# EAGLE design Adafruit 2.7in Tri-Color eInk Display with EYESPI (EAGLE 9.6.2)
COMPANY: ADAFRUIT INDUSTRIES; DRAWN: K. TOWNSEND; REV: A
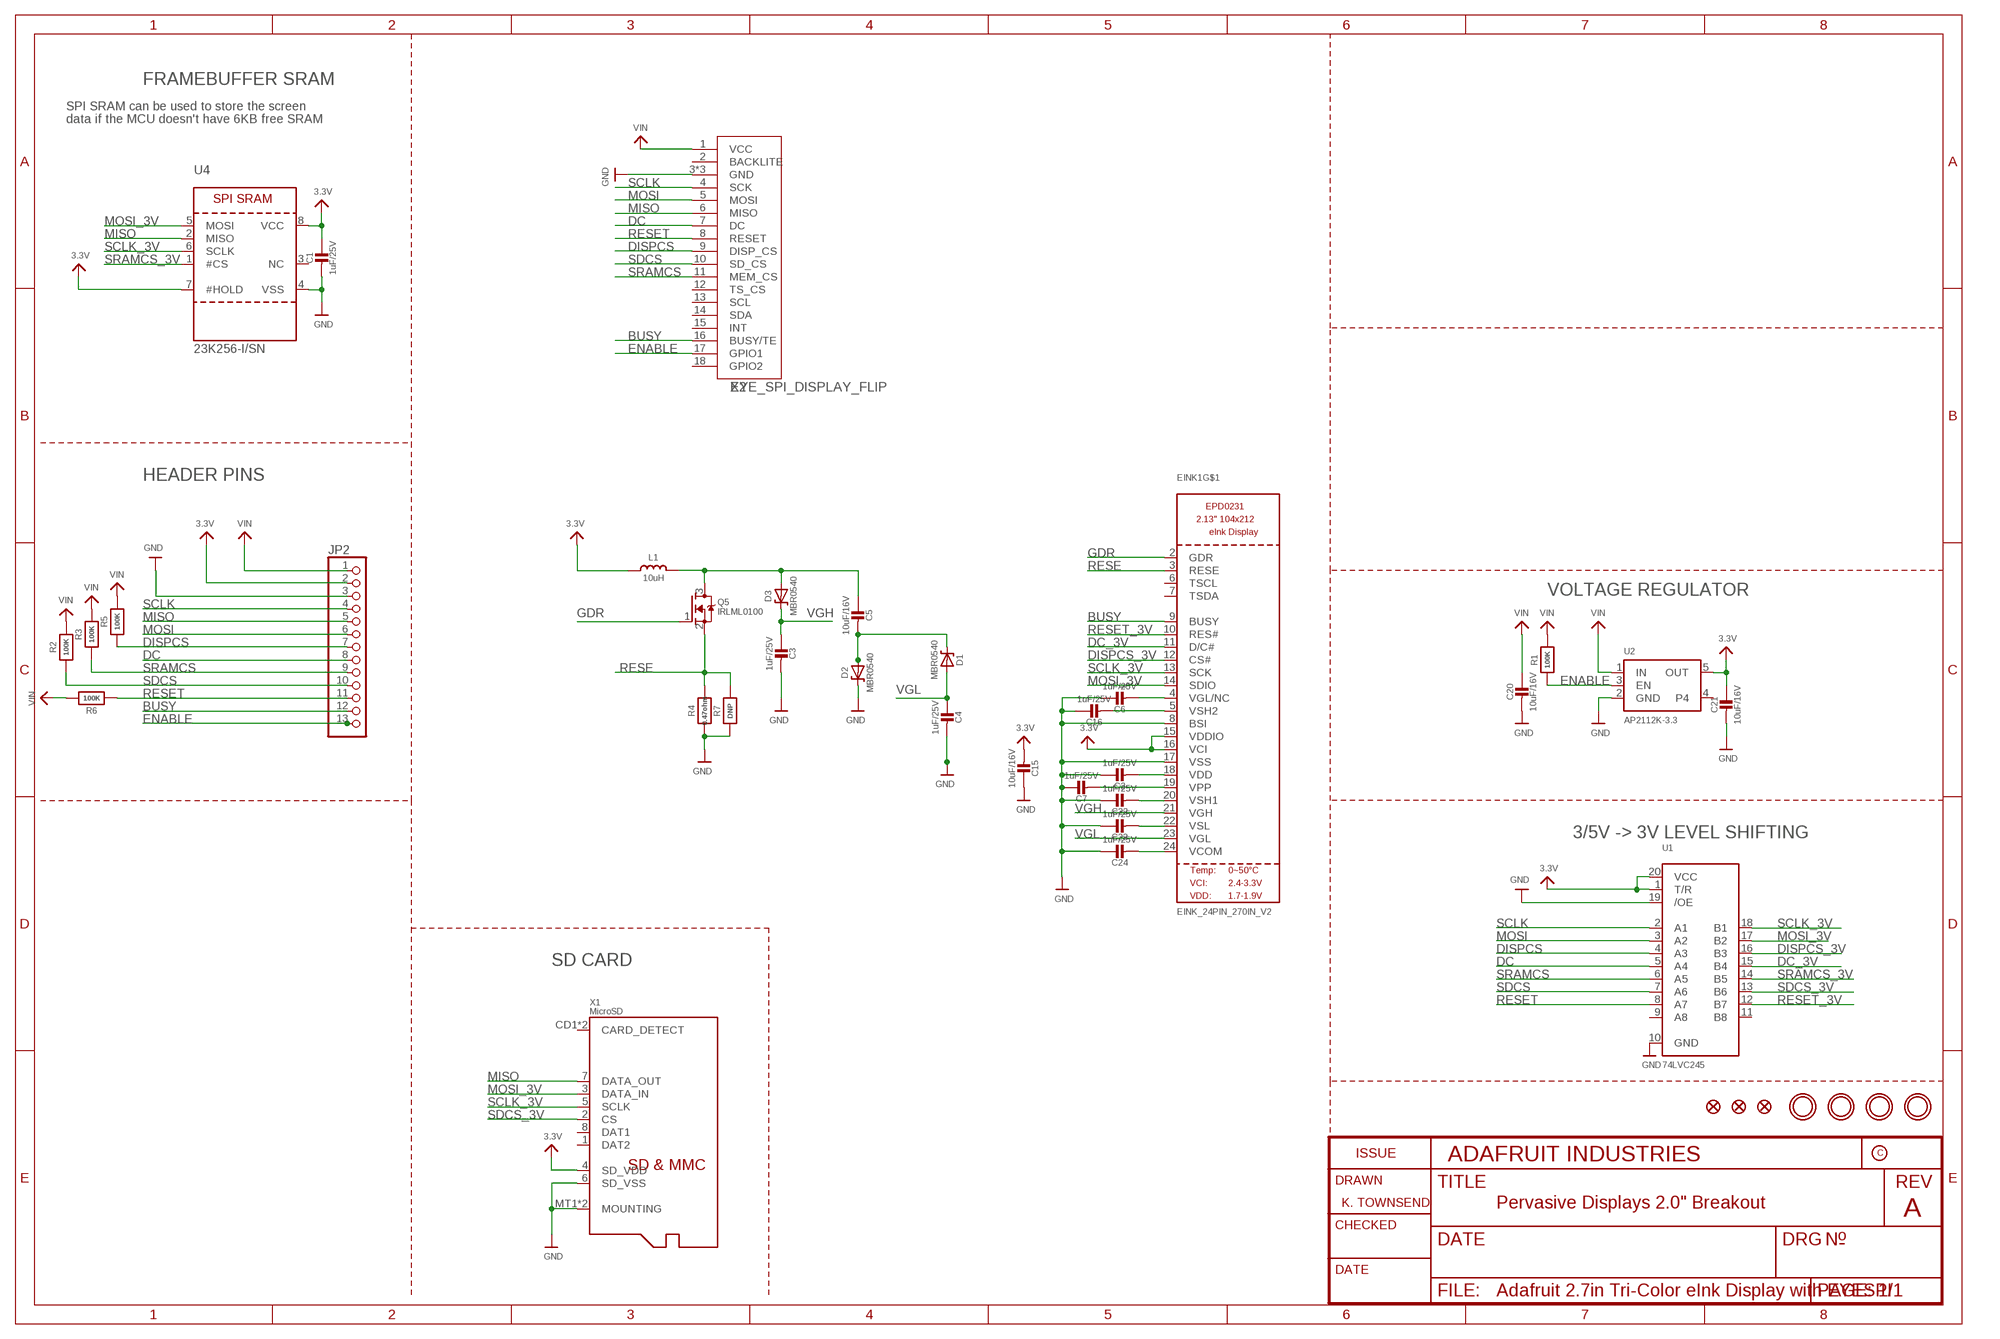
[diagram p0: schematic, sheet 1]

## Parts
C1  1uF/25V  CAP_CERAMIC0603_NO  [0603-NO]
C2  1uF/25V  CAP_CERAMIC0603_NO  [0603-NO]
C3  1uF/25V  CAP_CERAMIC0603_NO  [0603-NO]
C4  1uF/25V  CAP_CERAMIC0603_NO  [0603-NO]
C5  10uF/16V  CAP_CERAMIC0805-NOOUTLINE  [0805-NO]
C6  1uF/25V  CAP_CERAMIC0603_NO  [0603-NO]
C7  1uF/25V  CAP_CERAMIC0603_NO  [0603-NO]
C15  10uF/16V  CAP_CERAMIC0805-NOOUTLINE  [0805-NO]
C16  1uF/25V  CAP_CERAMIC0603_NO  [0603-NO]
C20  10uF/16V  CAP_CERAMIC0805-NOOUTLINE  [0805-NO]
C21  10uF/16V  CAP_CERAMIC0805-NOOUTLINE  [0805-NO]
C22  1uF/25V  CAP_CERAMIC0603_NO  [0603-NO]
C23  1uF/25V  CAP_CERAMIC0603_NO  [0603-NO]
C24  1uF/25V  CAP_CERAMIC0603_NO  [0603-NO]
D1  MBR0540  DIODE-SCHOTTKYSOD-123  [SOD-123]
D2  MBR0540  DIODE-SCHOTTKYSOD-123  [SOD-123]
D3  MBR0540  DIODE-SCHOTTKYSOD-123  [SOD-123]
EINK1  EINK_24PIN_270IN_V2  [EINK_270IN_V2]
FID1  FIDUCIAL_1MM  [FIDUCIAL_1MM]
FID2  FIDUCIAL_1MM  [FIDUCIAL_1MM]
FID3  FIDUCIAL_1MM  [FIDUCIAL_1MM]
JP2  HEADER-1X13  [1X13_ROUND_70]
L1  10uH  INDUCTORNR401  [INDUCTOR_4X4MM_NR401]
Q5  IRLML0100  MOSFET-NWIDE  [SOT23-WIDE]
R1  100K  RESISTOR_0603_NOOUT  [0603-NO]
R2  100K  RESISTOR_0603_NOOUT  [0603-NO]
R3  100K  RESISTOR_0603_NOOUT  [0603-NO]
R4  0.47ohm  RESISTOR_0603_NOOUT  [0603-NO]
R5  100K  RESISTOR_0603_NOOUT  [0603-NO]
R6  100K  RESISTOR_0603_NOOUT  [0603-NO]
R7  DNP  RESISTOR_0603_NOOUT  [0603-NO]
U1  74LVC245  74LCX245_TSSOP20  [TSSOP20]
U2  AP2112K-3.3  VREG_SOT23-5  [SOT23-5]
U4  23K256-I/SN  SRAM_SPI_SOIC8  [SOIC8_150MIL]
U$3  MOUNTINGHOLE2.5  [MOUNTINGHOLE_2.5_PLATED]
U$4  MOUNTINGHOLE2.5  [MOUNTINGHOLE_2.5_PLATED]
U$5  MOUNTINGHOLE2.5  [MOUNTINGHOLE_2.5_PLATED]
U$6  MOUNTINGHOLE2.5  [MOUNTINGHOLE_2.5_PLATED]
X1  MicroSD  MICROSD  [MICROSD]
X2  EYE_SPI_DISPLAY_FLIP  [EYE_SPI_DISPLAY_BOTCONTACT]

## Nets
3.3V: C1.1 C15.2 C21.1 EINK1.15(VDDIO) EINK1.16(VCI) JP2.2 L1.P$2 U1.1(T/R) U1.20(VCC) U2.5(OUT) U4.7(#HOLD) U4.8(VCC) X1.4(SD_VDD)
BUSY: EINK1.9(BUSY) JP2.12 X2.16(BUSY/TE)
DC: JP2.8 U1.5(A4) X2.7(DC)
DC_3V: EINK1.11(D/C#) U1.15(B4)
DISPCS: JP2.7 R5.1 U1.4(A3) X2.9(DISP_CS)
DISPCS_3V: EINK1.12(CS#) U1.16(B3)
ENABLE: JP2.13 R1.1 U2.3(EN) X2.17(GPIO1)
GDR: EINK1.2(GDR) Q5.1(G)
GND: C1.2 C2.1 C3.2 C4.2 C6.1 C7.1 C15.1 C16.1 C20.2 C21.2 C22.1 C23.1 C24.1 D2.C EINK1.8(BSI) EINK1.17(VSS) JP2.3 R4.2 R7.2 U1.10(GND) U1.19(/OE) U2.2(GND) U4.4(VSS) X1.6(SD_VSS) X1.MT1(MOUNTING) X1.MT2(MOUNTING) X2.3(GND) X2.SUPPORT1(GND) X2.SUPPORT2(GND)
MISO: JP2.5 U4.2(MISO) X1.7(DATA_OUT) X2.6(MISO)
MOSI: JP2.6 U1.3(A2) X2.5(MOSI)
MOSI_3V: EINK1.14(SDIO) U1.17(B2) U4.5(MOSI) X1.3(DATA_IN)
N$1: C7.2 EINK1.19(VPP)
N$2: C5.2 D1.C D2.A
N$3: C5.1 D3.A L1.P$1 Q5.3(D)
N$4: C16.2 EINK1.5(VSH2)
N$5: C2.2 EINK1.18(VDD)
N$6: C22.2 EINK1.20(VSH1)
N$9: C6.2 EINK1.4(VGL/NC)
N$27: C23.2 EINK1.22(VSL)
N$33: C24.2 EINK1.24(VCOM)
RESE: EINK1.3(RESE) Q5.2(S) R4.1 R7.1
RESET: JP2.11 R6.1 U1.8(A7) X2.8(RESET)
RESET_3V: EINK1.10(RES#) U1.12(B7)
SCLK: JP2.4 U1.2(A1) X2.4(SCK)
SCLK_3V: EINK1.13(SCK) U1.18(B1) U4.6(SCLK) X1.5(SCLK)
SDCS: JP2.10 R2.1 U1.7(A6) X2.10(SD_CS)
SDCS_3V: U1.13(B6) X1.2(CS)
SRAMCS: JP2.9 R3.1 U1.6(A5) X2.11(MEM_CS)
SRAMCS_3V: U1.14(B5) U4.1(#CS)
VGH: C3.1 D3.C EINK1.21(VGH)
VGL: C4.1 D1.A EINK1.23(VGL)
VIN: C20.1 JP2.1 R1.2 R2.2 R3.2 R5.2 R6.2 U2.1(IN) X2.1(VCC)
Unconnected: EINK1.6(TSCL) EINK1.7(TSDA) EINK1.SPRT1(MT) EINK1.SPRT2(MT) U1.9(A8) U1.11(B8) U2.4 U4.3(NC) X1.1(DAT2) X1.8(DAT1) X1.CD1(CARD_DETECT) X1.CD2(CARD_DETECT) X2.2(BACKLITE) X2.12(TS_CS) X2.13(SCL) X2.14(SDA) X2.15(INT) X2.18(GPIO2)

## Notes on the sheet
- FRAMEBUFFER SRAM
- SPI SRAM can be used to store the screen
- data if the MCU doesn't have 6KB free SRAM
- HEADER PINS
- VOLTAGE REGULATOR
- 3/5V -> 3V LEVEL SHIFTING
- SD CARD
- Pervasive Displays 2.0" Breakout

## Library data of the parts
C1-C7 C15 C16 C20-C24 = microbuilder:CAP_CERAMIC: Ceramic Capacitors For new designs, use the packages preceded by an '_' character since they are more reliable: The following footprints should be used on most boards: _0402 - Standard footprint for regular board layouts _0603 - Standard footprint for regular board layouts _0805 - Standard footprint for regular board layouts _1206 - Standard footprint for regular board layouts For extremely tight-pitch boards where space is at a premium, the following 'micro-pitch' footprints can be used (smaller pads, no silkscreen outline, etc.): _0402MP - Micro-pitch footprint for very dense/compact boards _0603MP - Micro-pitch footprint for very dense/compact boards _0805MP - Micro-pitch footprint for very dense/compact boards _1206MP - Micro-pitch footprint for very dense/compact boards
D1-D3 = microbuilder:DIODE-SCHOTTKY
EINK1 = adafruit_display:EINK_24PIN
FID1-FID3 = microbuilder:FIDUCIAL: Fiducial Alignment Points Various fiducial points for machine vision alignment.; BOM: EXCLUDE
JP2 = microbuilder:HEADER-1X13
L1 = microbuilder:INDUCTOR: Inductors 0603: 10nH Ceramic Inductor - microwire antenna/RF (Digikey: 712-1434-2-ND) 0805: 560nH Ceramic Inductor - RF (Digikey: 553-1047-1-ND) 270nH Ceramic Inductor - Q = 40@250MHz, +-5%, 1 Ohm DC Resistance (Digikey: 535-10506-2-ND) 1007 (2518 Metric) SMT: 10µH 10% 250mOhm 820mA 1007 Inductor (Digikey: 587-2189-1-ND) 22µH 10% 500mOhm 580mA 1007 Inductor (Digikey: 587-2190-1-ND) 47µH 10% 950mOhm 420mA 1007 Inductor (Digikey: 587-2191-1-ND) 47µH 5% 100mOhm 1A 1008 Inductor (Digikey: 732-1816-1-ND) 5.0x5.0mm (Taiyo Yuden NR5040 Series) 6.8µH 20% 2.3A 64mOhm Inductor (Digikey: 587-2374-2-ND) 5.0x5.0mm (TDK VLC5045 Series) 4.7µH 20% 3.3A 34mOhm Inductor (Digikey: 445-6526-1-ND) 6.8µH 20% 2.7A 46mOhm Inductor (Digikey: 445-6527-1-ND) 6.0x6.0mm (TDK VLC6045 Series) 4.7µH 20% 3.8A 27mOhm Inductor (Digikey: 445-6538-2-ND) 6.8µH 20% 3A 41mOhm Inductor (Digikey: 445-6540-1-ND) 6.2µH 30% 2.2A 45mOhm Inductor (Digikey: SRR5028-6R2YCT-ND) - Not TDK VLC6045 but footprint should match 6.0x6.0mm (TDK SLF6045 Series) 6.8uH 30% 2A 33mOhm Inductor (Digikey: 445-4572-1-ND, Mouser: 810-SLF645T6R8N2R0PF) 6.0x6.0mm (Sumida CDRH5D28 Series) 6.2uH 30% 1.8A 45mOhm Inductor (Digikey: 308-1542-1-ND) Taiyo Yuden NR3015T2R2M - 2.2uH 20% 1.5A (Digikey: 587-1648-2-ND, Mouser: 963-NR3015T2R2M) - Used with TI TPS62172 CoilCraft RFID Transponder Coil - MA5532-AE (For use with AS3935 Lightning Sensor) Taiyo Yuden NRH2412T2R2MNGH - 2.2uH 20% 1AA (Digikey: 587-3443-1-ND) - Used with TI LM3671 Vishay IHLP 1.0uH Molded Inductor - 24mOhm DCR, 5A, +/-20%, -55°C-125°C (Digikey: 541-1319-1-ND)
Q5 = microbuilder:MOSFET-N: N-Channel Mosfet LEGEND VDS: Voltage Drain-Source ID: Drain Current RDS(ON): Drain-Source On-State Resistance VGS(TH): Gate-Source Threshold Voltage CISS: Drain-Source Input Capacitance SOT-23 Name VDS ID RDS(ON) VGS(TH) CISS Order Number 2N7002E 60V 260mA 2.5 Ohm 2.5V @ 250uA 26.7pF @ 25V 2N7002ET1GOSTR-ND BSH103 30V 850mA 400 mOhm 400mV @ 1mA 83pF @ 24V BSH103,235-ND BSS138 60V 320mA 1.6 Ohm 1.5V @ 250uA 50pF @ 10V Mouser: 771-BSS138PW115 DMN2075U-7 20V 4.2A 38 mOhm 1V @ 250 uA 594.3pF @ 10V DMN2075U-7DICT-ND * BSS138 good choice for I2C level-shifting POWERPAK 1212-8 Name VDS ID RDS(ON) VGS(TH) CISS Order Number Si7308DN 60V 6A 58 mOhm 3V @ 250uA 665pF @ 15V SI7308DN-T1-E3CT-ND
R1-R7 = microbuilder:RESISTOR: Resistors For new designs, use the packages preceded by an '_' character since they are more reliable: The following footprints should be used on most boards: _0402 - Standard footprint for regular board layouts _0603 - Standard footprint for regular board layouts _0805 - Standard footprint for regular board layouts _1206 - Standard footprint for regular board layouts For extremely tight-pitch boards where space is at a premium, the following 'micro-pitch' footprints can be used (smaller pads, no silkscreen outline, etc.): _0402MP - Micro-pitch footprint for very dense/compact boards _0603MP - Micro-pitch footprint for very dense/compact boards _0805MP - Micro-pitch footprint for very dense/compact boards _1206MP - Micro-pitch footprint for very dense/compact boards
U1 = microbuilder:74LCX245: 74LCX245MTC - 5.0V Tolerant Bi-Directional Buffer Can be used to interface 5.0V logic to 2.5 or 3.3V devices Digikey: 74LCX245MTCXTR-ND Mouser: 512-74LCX245MTCX
U2 = adafruit_power:VREG_SOT23-5: SOT23-5 Fixed Voltage Regulators Part Current Out V Out V In V Dropout θJA (°C/W) TJ (°C) Digikey Part No. ADP121 150mA 3.3V 3.4-5.5V 0.09V @ 150mA -- -- ADP121-AUJZ33R7CT-ND ADP121 150mA 3.0V 3.1-5.5V 0.09V @ 150mA -- -- ADP121-AUJZ30R7CT-ND ADP122 300mA 3.3V 3.4-5.5V 0.085V @ 300mA -- -- ADP122AUJZ-3.3-R7CT-ND ADP1712 300mA 3.3V 3.5-5.5V 0.17V @ 300mA -- -- ADP1712AUJZ-3.3-R7TR-ND AP7311 (Low Cost) 150mA 3.3V 3.5-6V 0.15V @ 150mA -- -- AP7311-33WG-7DICT-ND LD39015M18R 150mA 1.8V 1.9V-5.5V 0.08V @ 100mA -- -- 497-6977-1-ND LP2985A-33DBVR 150mA 3.3V 3.3-16V 0.28V @ 150mA 206 150 296-18479-1-ND MCP1824T-3302E/OT 300mA 3.3V 3.5V-6V 0.2V @ 300mA -- -- MCP1824T-3302E/OTCT-ND MIC5205-2.5YM5 TR 150mA 2.5V 2.7-16V 0.165V @ 150mA -- -- 576-1257-2-ND MIC5205-3.0YM5 TR 150mA 3.0V 3.2V-16V 0.165V @ 150mA -- -- 576-1258-2-ND MIC5205-3.3YM5 TR 150mA 3.3V 3.5V-16V 0.165V @ 150mA -- -- 576-1259-2-ND TPS780330220 150mA 3.3V+2.2V 3.6-5.5V 250mV Max -- -- 296-23332-1-ND TDA3663/N1,135 100mA 3.3V 3.5-45V 0.18V @ 50mA -- -- 568-5343-1-ND Max operating temp can be calculated using θJA, TJ (max junction temperature), and power in watts. Set the "Maximum Ambient Temperature" until it reaches TJ ("Max Junction Temperature"), which is the absolute limit for safe use of the regulator: Heat Sink Temperature Calculator <http://www.daycounter.com/Calculators/Heat-Sink-Temperature-Calculator.phtml> For example, With 12V source into a 3.3V LP2985 and a 30mA load, we are dissipating (12V-3.3V) * 0.03A = 0.261W. With a θJA of 206 °C/W, a TJ of 150°C, and 261mW we can safely use the chip without a heat sink up to 75°C (=147.1°C Junction Temperature).; JLC_ROTATION: 0
U4 = microbuilder:SRAM_SPI_SOIC8: SRAM - 8-Pin SPI Interface 23K640-I/SN - 8KB (64Kb), 20MHz, 2.7-3.6V 23K256-I/SN - 32KB (256Kb), 20MHz, 2.7-3.6V 23LC512-I/SN - 64KB (512Kb), 20MHz, 2.7-3.6V
U$3-U$6 = adafruit_electromech:MOUNTINGHOLE: Mounting Hole For #2 screws (0.086"/2.18mm width, 0.094"/2.4mm hole) use 2.5mm; BOM: EXCLUDE
X1 = adafruit_electromech:MICROSD: MicroSD/Transflash Card Holder with SPI pinout 3M: 2908-05WB-MG 4UConnector: 19656 Footprint courtesy: Adafruit Industries; JLC_ROTATION: 90; LCSC: C125617
X2 = adafruit_display:EYE_SPI_DISPLAY; LCSC: C2856802

## Board
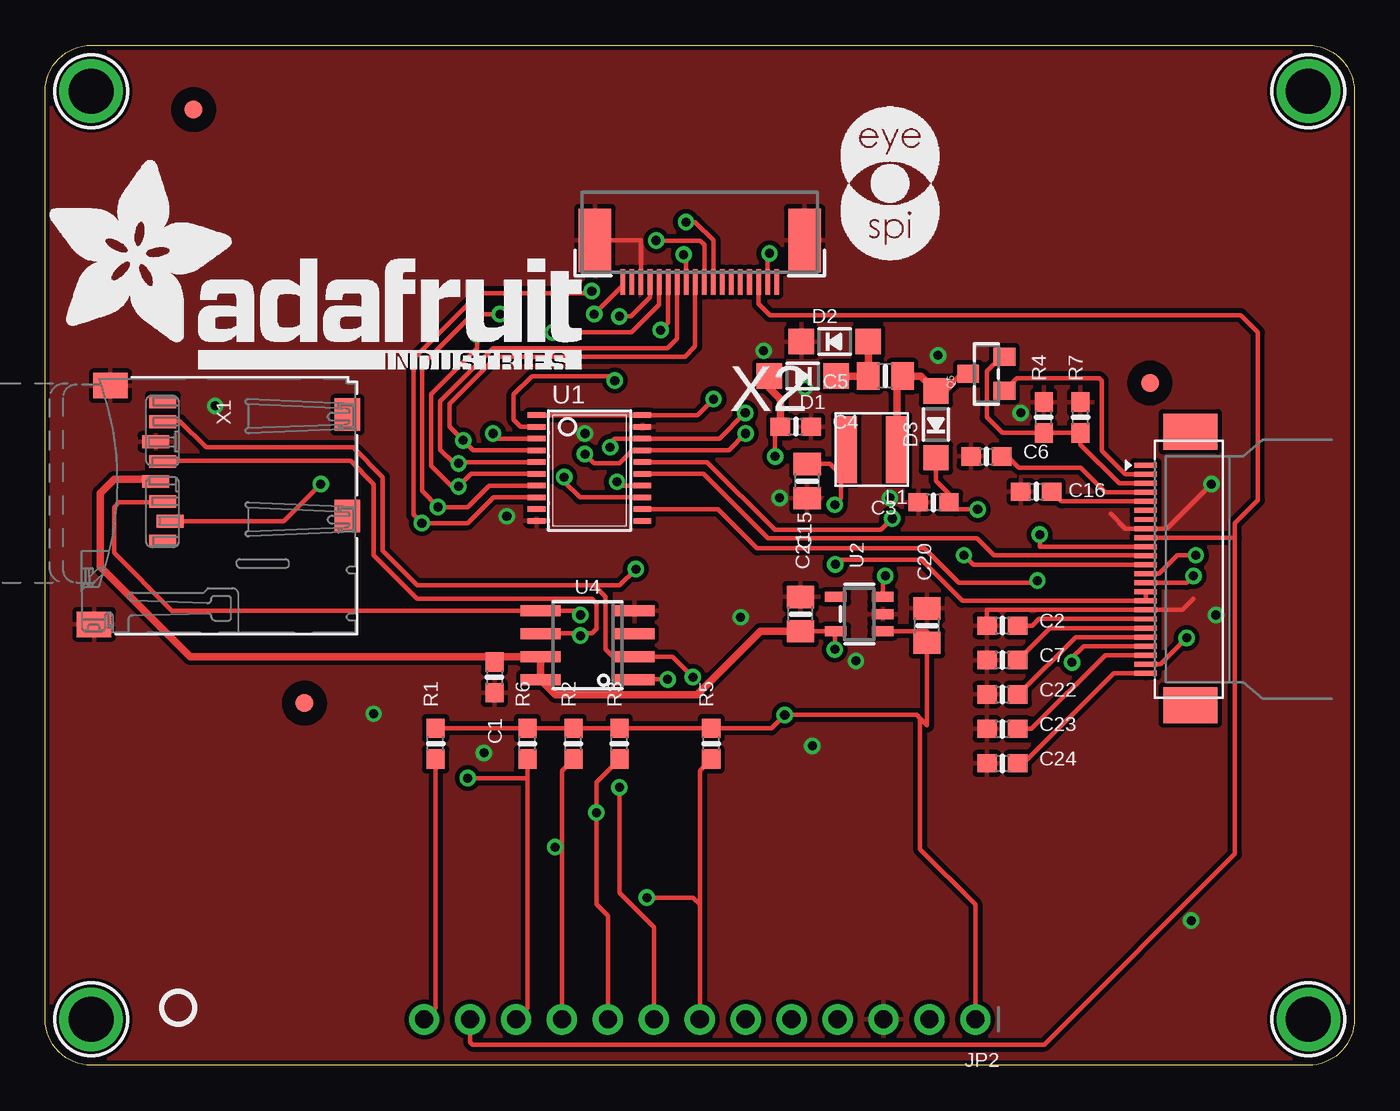
[diagram p1: board, top side]
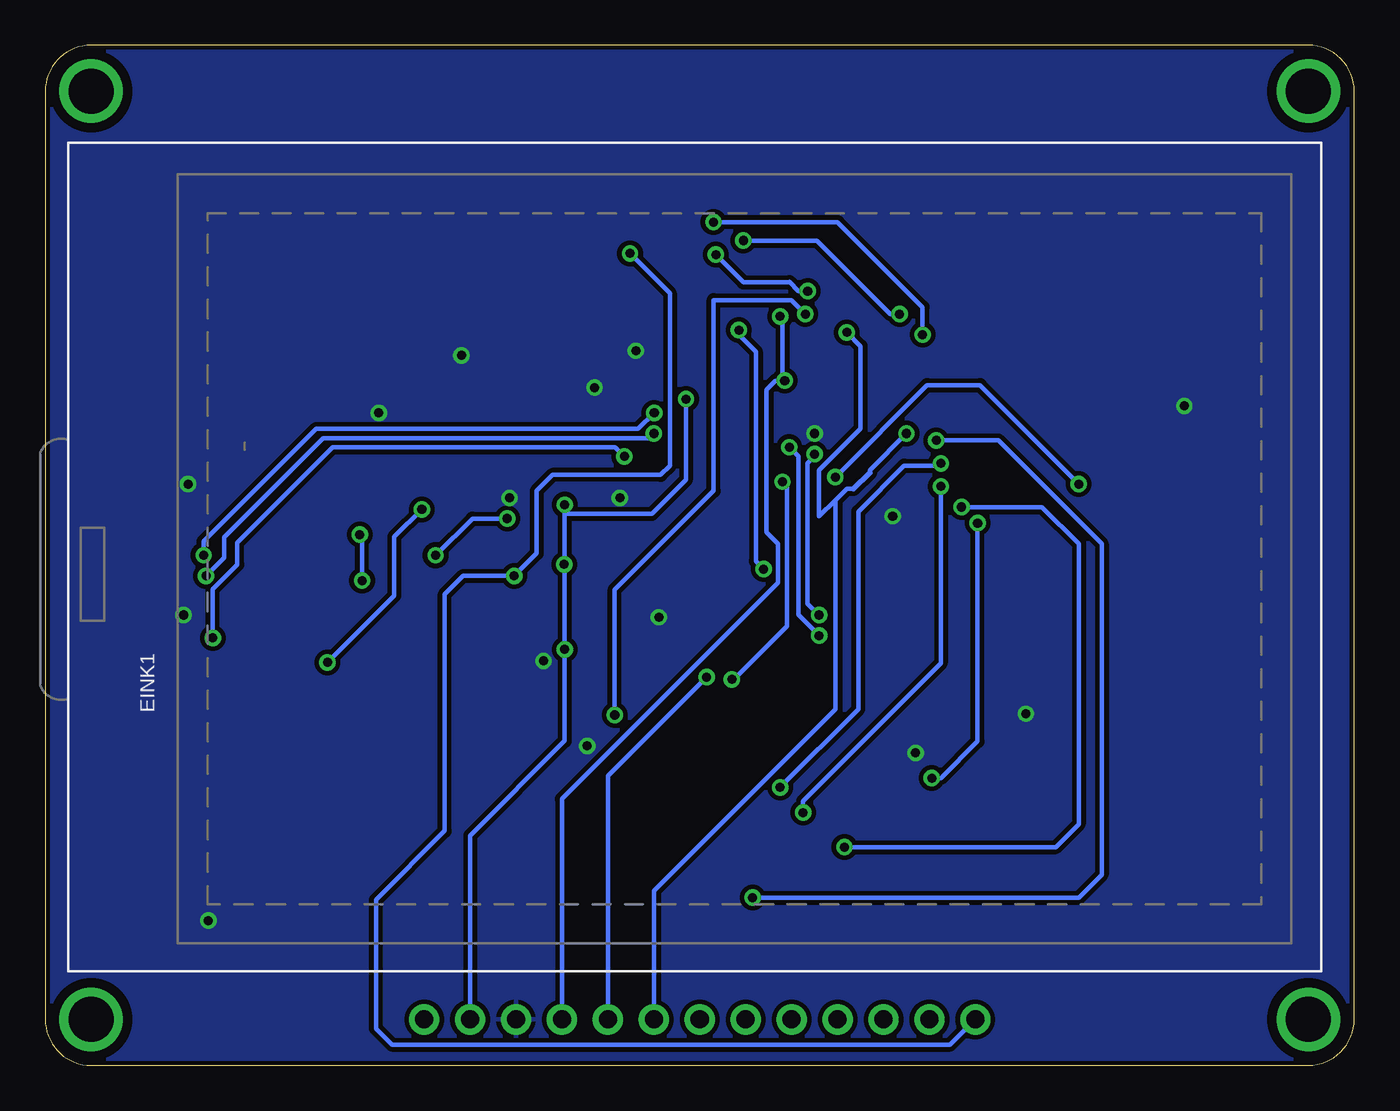
[diagram p2: board, bottom side, seen from below]

Size 72.39 x 56.39 mm. Coordinates in mm from the lower left corner, seen from the top.
Outline: 2.54,56.39 69.85,56.39 arc-90 72.39,53.85 72.39,2.54 arc-90 69.85,0 2.54,0 arc-90 0,2.54 0,53.85 arc-90 2.54,56.39
Copper layers (1*16): Top 0.035mm / dielectric 1.5mm / Bottom 0.035mm
Design rules "adafruit *": minimum track width 8mil, minimum drill 15.5mil, track to track 8mil, track to pad 8mil, pad to pad 8mil, via to via 8mil, smd to smd 8mil, copper to edge 10mil, drill to drill 8mil, minimum pad ring 10mil, minimum via ring 8mil, stop-mask expansion 2mil, vias tented up to drill 20mil, thermal gap 10mil

### Footprints (pad centres in the part's own frame; a part is rotated, then mirrored left to right if it is on the bottom)
0603-NO = smd 1.075 x 1: 1 -0.85,0; 2 0.85,0
0805-NO = smd 1.24 x 1.5: 1 -0.95,0; 2 0.95,0
SOD-123 = smd 1.4 x 1.4: A 1.85,0; C -1.85,0
EINK_270IN_V2 = smd 0.275 x 1.25 bottom: 1 5.75,-1.04; 2 5.25,-1.04; 3 4.75,-1.04; 4 4.25,-1.04; 5 3.75,-1.04; 6 3.25,-1.04; 7 2.75,-1.04; 8 2.25,-1.04; 9 1.75,-1.04; 10 1.25,-1.04; 11 0.75,-1.04; 12 0.25,-1.04; 13 -0.25,-1.04; 14 -0.75,-1.04; 15 -1.25,-1.04; 16 -1.75,-1.04; 17 -2.25,-1.04; 18 -2.75,-1.04; 19 -3.25,-1.04; 20 -3.75,-1.04; 21 -4.25,-1.04; 22 -4.75,-1.04; 23 -5.25,-1.04; 24 -5.75,-1.04 | smd 2 x 3 bottom: SPRT1 7.6,1.42; SPRT2 -7.51,1.42
FIDUCIAL_1MM = smd 1 x 1: 1 0,0
1X13_ROUND_70 = drill 1 pad 1.676: 1 -15.24,0; 2 -12.7,0; 3 -10.16,0; 4 -7.62,0; 5 -5.08,0; 6 -2.54,0; 7 0,0; 8 2.54,0; 9 5.08,0; 10 7.62,0; 11 10.16,0; 12 12.7,0; 13 15.24,0
INDUCTOR_4X4MM_NR401 = smd 1.2 x 3.7: P$1 -1.4,0; P$2 1.4,0
SOT23-WIDE = smd 1 x 1.2: 1 -0.95,-1; 2 0.95,-1; 3 0,1
TSSOP20 = smd 0.305 x 0.991: 1 -2.925,-2.918; 2 -2.275,-2.918; 3 -1.625,-2.918; 4 -0.975,-2.918; 5 -0.325,-2.918; 6 0.325,-2.918; 7 0.975,-2.918; 8 1.625,-2.918; 9 2.275,-2.918; 10 2.925,-2.918; 11 2.925,2.918; 12 2.275,2.918; 13 1.625,2.918; 14 0.975,2.918; 15 0.325,2.918; 16 -0.325,2.918; 17 -0.975,2.918; 18 -1.625,2.918; 19 -2.275,2.918; 20 -2.925,2.918
SOT23-5 = smd 0.55 x 1.2: 1 -0.95,-1.3; 2 0,-1.3; 3 0.95,-1.3; 4 0.95,1.3; 5 -0.95,1.3
SOIC8_150MIL = smd 0.6 x 2.2: 1 -1.905,-2.6; 2 -0.635,-2.6; 3 0.635,-2.6; 4 1.905,-2.6; 5 1.905,2.6; 6 0.635,2.6; 7 -0.635,2.6; 8 -1.905,2.6
MOUNTINGHOLE_2.5_PLATED = drill 2.5 pad 3.2: P$1 0,0
MICROSD = smd 0.7 x 1.5: 1 1.761,-3.147; 2 0.661,-2.747; 3 -0.439,-3.147; 4 -1.539,-3.547; 5 -2.639,-3.147; 6 -3.739,-3.547; 7 -4.839,-3.147; 8 -5.939,-3.147 | smd 1.8 x 1.4: CD1 -5.239,7.053; CD2 0.38,7.053 | smd 1.4 x 1.9: MT1 -6.839,-6.047; MT2 6.361,-6.947
EYE_SPI_DISPLAY_BOTCONTACT = smd 0.25 x 1.4: 1 4.25,1.154; 2 3.75,1.154; 3 3.25,1.154; 4 2.75,1.154; 5 2.25,1.154; 6 1.75,1.154; 7 1.25,1.154; 8 0.75,1.154; 9 0.25,1.154; 10 -0.25,1.154; 11 -0.75,1.154; 12 -1.25,1.154; 13 -1.75,1.154; 14 -2.25,1.154; 15 -2.75,1.154; 16 -3.25,1.154; 17 -3.75,1.154; 18 -4.25,1.154 | smd 1.8 x 3.5: SUPPORT1 -5.8,-1.152; SUPPORT2 5.8,-1.152

### Placement (x,y rotation side)
C1  24.84,21.44 270 top
C2  52.93,24.31 0 top
C3  49.12,31.11 180 top
C4  41.5,35.31 0 top
C5  46.46,38.1 180 top
C6  52.04,33.66 0 top
C7  52.93,22.4 0 top
C15  42.13,32.3 90 top
C16  54.8,31.71 0 top
C20  48.76,24.31 90 top
C21  41.77,24.94 90 top
C22  52.93,20.5 0 top
C23  52.93,18.59 0 top
C24  52.93,16.69 0 top
D1  41.88,38.1 180 top
D2  43.66,40.01 0 top
D3  49.25,35.43 90 top
EINK1  61.9,27.42 90 bottom
FID1  8.21,52.83 0 top
FID2  14.34,20.02 90 top
FID3  61.09,37.72 0 top
JP2  36.2,2.54 180 top
L1  45.69,34.04 180 top
PLABEL0  [PLABEL0]  50.31,3.72 0 top
PLABEL1  [PLABEL1]  32.43,0.47 0 top
PLABEL2  [PLABEL2]  45.03,3.72 0 top
PLABEL3  [PLABEL3]  37.04,0.38 0 top
PLABEL4  [PLABEL4]  39.66,3.81 0 top
PLABEL5  [PLABEL5]  42.59,0.32 0 top
PLABEL6  [PLABEL6]  34.84,3.81 0 top
PLABEL7  [PLABEL7]  29.26,3.68 0 top
PLABEL8  [PLABEL8]  24.81,3.68 0 top
PLABEL9  [PLABEL9]  21.77,0.38 0 top
PLABEL10  [PLABEL10]  26.86,0.38 0 top
PLABEL11  [PLABEL11]  47.54,0.34 0 top
PLABEL12  [PLABEL12]  19.73,3.68 0 top
PLABEL13  [PLABEL13]  36.7,11.81 0 top
PLABEL14  [PLABEL14]  35.18,7.37 0 top
PLABEL15  [PLABEL15]  52.6,3.72 0 bottom
PLABEL16  [PLABEL16]  50.21,0.34 0 bottom
PLABEL17  [PLABEL17]  47.7,3.72 0 bottom
PLABEL18  [PLABEL18]  40.59,0.38 0 bottom
PLABEL19  [PLABEL19]  42.71,3.81 0 bottom
PLABEL20  [PLABEL20]  45.13,0.32 0 bottom
PLABEL21  [PLABEL21]  37.38,3.81 0 bottom
PLABEL22  [PLABEL22]  32.81,3.68 0 bottom
PLABEL23  [PLABEL23]  27.35,3.68 0 bottom
PLABEL24  [PLABEL24]  25.33,0.38 0 bottom
PLABEL25  [PLABEL25]  30.42,0.38 0 bottom
PLABEL26  [PLABEL26]  34.97,0.47 0 bottom
PLABEL27  [PLABEL27]  22.27,3.68 0 bottom
PLABEL28  [PLABEL28]  36.2,53.59 0 bottom
Q5  52.04,38.23 90 top
R1  21.59,17.78 90 top
R2  29.21,17.78 90 top
R3  31.75,17.78 90 top
R4  55.22,35.81 90 top
R5  36.83,17.78 90 top
R6  26.67,17.78 90 top
R7  57.25,35.81 90 top
U1  30.1,33.02 270 top
U2  45.01,24.94 90 top
U4  29.99,23.22 90 top
U$1  [EYESPI_MINI_LOGO]  43.94,44.45 0 top
U$3  69.85,2.54 0 top
U$4  2.54,2.54 0 top
U$5  69.85,53.85 0 top
U$6  2.54,53.85 0 top
U$9  [PCBFEAT-REV-040]  7.37,3.17 0 top
U$39  [ADAFRUIT_TEXT_30MM]  0,38.48 0 top
X1  9.65,30.73 270 top
X2  36.2,44.45 180 top

### Tracks (layer width: path | path; a pad name or v marks a point on that pad's centre or on a via)
3.3V  (via drill 0.5)
  Top 0.254: C15.2 43.4,33.25 44.01,32.64 44.01,31.34 v43.66,30.99 | C21.1 U2.5 43.66,23.94 v43.66,22.99 | C1.1 24.84,22.59 | EINK1.15 EINK1.16 50.72,25.67 48.45,27.94 43.94,27.94 v43.69,27.69 | C21.1 | X1.4 6.04,32.34 6.04,32.38 | v36.96,36.83 36.07,35.95 U1.20 U1.1
  Top 0.406: L1.P$2 44.01,33.75 44.01,32.64 | 6.04,32.38 3.81,32.38 3.05,31.62 3.05,27.56 8.02,22.59 24.84,22.59 U4.7 U4.8 28.23,20.48 36.04,20.48 39.56,23.99 C21.1
  Bottom 0.254: v43.66,30.99 43.66,30.48 | 43.66,30.48 43.66,27.94 | 43.66,27.94 v43.66,22.99 43.66,17.93 48.9,12.7 JP2.2 | v36.96,36.83 36.96,32.36 38.84,30.48 43.66,30.48 | v43.69,27.69 43.69,27.94 43.66,27.94
BUSY
  Top 0.254: JP2.12 23.5,1.27 23.62,1.14 55.24,1.14 65.79,11.68 65.79,29.17 | X2.16 39.45,42.09 40.07,41.47 66.1,41.47 67.06,40.51 67.06,31.24 65.79,29.97 65.79,29.17 | EINK1.9 65.79,29.17
DC  (via drill 0.5)
  Top 0.254: v31.75,15.37 31.75,9.53 33.66,7.62 JP2.8 | X2.7 34.95,40.15 34.42,39.62 24.77,39.62 21.84,36.7 21.84,34.04 22.61,33.27 v22.86,33.27 22.93,33.34 U1.5
  Bottom 0.254: v31.75,15.37 27.43,19.68 27.43,30.61 24.89,33.15 22.99,33.15 v22.86,33.27
DC_3V
  Top 0.254: EINK1.11 60.84,28.19 52.45,28.19 51.51,29.13 39.95,29.13 36.39,32.7 U1.15
DISPCS  (via drill 0.5)
  Top 0.254: R5.1 36.2,16.3 36.2,8.89 | 36.2,8.89 JP2.7 | 36.2,8.89 35.81,9.27 v33.27,9.27 | X2.9 35.95,39.74 35.37,39.17 24.95,39.17 22.35,36.56 22.35,35.31 v23.11,34.54 23.66,33.99 U1.4
  Bottom 0.254: v23.11,34.54 19.68,34.54 13.97,28.83 13.97,10.54 15.24,9.27 v33.27,9.27
DISPCS_3V  (via drill 0.5)
  Top 0.254: v46.84,30.23 46.2,29.59 40.36,29.59 36.61,33.34 U1.16 | v50.8,28.19 51.32,27.67 EINK1.12
  Bottom 0.254: v50.8,28.19 48.77,30.23 v46.84,30.23
ENABLE  (via drill 0.5)
  Top 0.254: v46.46,27.05 46.31,26.91 U2.3 | R1.1 21.59,3.17 JP2.13 | X2.17 39.95,44.98 v40.05,44.88
  Bottom 0.254: JP2.13 22.35,1.14 53.21,1.14 54.1,2.03 54.1,9.14 50.29,12.95 50.29,26.04 49.28,27.05 v46.46,27.05 45.21,28.3 45.21,31.75 44.32,32.64 38.35,32.64 37.85,33.15 37.85,42.67 v40.05,44.88
GDR
  Top 0.254: EINK1.2 59.72,32.67 58.42,33.97 58.42,37.85 58.29,37.97 53.74,37.97 Q5.1
GND  (via drill 0.5)
  Top 0.254: X2.3 32.95,45.6 X2.SUPPORT2 | 58.93,30.48 59.74,29.67 EINK1.8 62.03,29.67 v64.49,32.13 | 63.5,25.78 62.89,25.17 EINK1.17 52.08,25.17 C2.1
  other vias: 39.73,39.5 49.38,39.24 38.46,24.77 44.83,22.35 40.61,31.37 42.42,17.65 18.16,19.43 9.4,36.45 63.37,8 24.26,17.27 29.84,34.92 46.71,31.37 42.01,37.47 64.74,24.89 53.95,36.07 25.53,30.35
  pour Top (isolate 0.254): 0,56.64 72.39,56.64 72.39,0 0,0
  pour Bottom (isolate 0.254): 0,56.64 72.39,56.64 72.39,0 0,0
MISO  (via drill 0.5)
  Top 0.254: 30.35,26.54 30.99,25.91 30.99,22.99 31.39,22.59 U4.2 34.69,22.59 v35.81,21.46 | 30.35,26.54 20.57,26.54 18.67,28.45 18.67,32.51 17.02,34.16 8.89,34.16 7.44,35.61 6.54,35.61 X1.7 | v32.66,27.43 31.77,26.54 30.35,26.54 | X2.6 34.45,41.05 v34.04,40.64
  Bottom 0.254: JP2.5 41.27,16 v35.81,21.46 | v34.04,40.64 34.04,40.39 33.1,39.45 33.1,27.87 v32.66,27.43
MOSI  (via drill 0.5)
  Top 0.254: X2.5 33.95,42.04 32.42,40.51 v28.07,40.51 | U1.3 25.05,34.65 v24.77,34.92
  Bottom 0.254: 26.8,32.77 26.8,32.89 v24.77,34.92 | 28.7,31.24 29.59,30.35 29.59,32.89 27.3,35.18 27.3,39.75 v28.07,40.51 | 28.7,31.24 28.07,31.88 27.69,31.88 | 28.7,31.24 28.7,19.68 38.73,9.65 JP2.6
  Bottom 0.305: 27.69,31.88 26.8,32.77
MOSI_3V  (via drill 0.5)
  Top 0.254: v29.59,24.89 29.36,25.12 U4.5 7.01,25.12 3.81,28.32 3.81,30.86 4.06,31.11 6.45,31.11 X1.3 | v63.5,27.05 63.12,26.67 EINK1.14 | v38.73,34.92 37.8,33.99 U1.17 32.47,33.99 31.75,33.27 30.35,33.27 v29.84,33.78
  Bottom 0.254: v29.59,24.89 30.23,25.53 30.23,33.27 29.78,33.72 v29.84,33.78 | v63.5,27.05 62.48,28.07 62.48,29.2 57.01,34.67 38.99,34.67 v38.73,34.92
N$1
  Top 0.254: EINK1.19 55.55,24.17 C7.2
N$2
  Top 0.406: D2.A C5.2 D1.C
N$3
  Top 0.254: Q5.3 50.67,38.23 50.17,37.72
  Top 0.406: L1.P$1 47.09,37.79 C5.1 48.43,38.1 D3.A 49.73,37.28 50.17,37.72
N$4
  Top 0.254: EINK1.5 56.19,31.17 C16.2
N$5
  Top 0.254: EINK1.18 54.95,24.67 54.58,24.31 C2.2
N$6
  Top 0.254: EINK1.20 56.99,23.67 53.82,20.5 C22.2
N$9
  Top 0.254: EINK1.4 58.63,31.67 57.28,33.02 53.85,33.02 53.21,33.66 C6.2
N$27
  Top 0.254: EINK1.22 58.61,22.67 54.53,18.59 C23.2
N$33
  Top 0.254: EINK1.24 59.08,21.67 54.1,16.69 C24.2
RESE
  Top 0.254: EINK1.3 59.4,32.17 57.25,34.31 R7.1 R4.1 52.92,34.96 52.07,35.81 52.07,38.35 52.89,39.18 Q5.2
RESET  (via drill 0.5)
  Top 0.254: R6.1 26.67,15.88 | 26.67,15.88 26.67,3.17 JP2.11 | v23.37,15.88 26.67,15.88 | v30.23,42.8 30.23,42.67 23.99,42.67 20.37,39.05 20.37,30.43 v20.83,29.97 23.37,29.97 24.79,31.39 U1.8 | v35.31,44.81 35.45,44.67 X2.8
  Bottom 0.254: v23.37,15.88 22.86,15.88 20.83,17.91 v20.83,29.97 | v30.23,42.8 30.73,42.8 31.24,43.31 31.24,43.29 33.78,43.29 v35.31,44.81
RESET_3V  (via drill 0.5)
  Top 0.254: v54.99,29.34 54.99,28.67 EINK1.10 | v54.86,26.8 54.74,26.67 50.52,26.67 48.62,28.57 39.37,28.57 37.2,30.75 U1.12
  Bottom 0.254: v54.86,26.8 54.86,29.46 v54.99,29.34
SCLK  (via drill 0.5)
  Top 0.254: X2.4 33.45,42.46 32.38,41.4 v31.75,41.4 | U1.2 26.3,35.3 25.91,35.69 25.91,37.08 26.92,38.1 31.24,38.1 v31.5,37.85
  Bottom 0.254: JP2.4 43.81,14.73 31.88,26.67 31.88,28.83 32.51,29.46 32.51,37.34 32,37.85 v31.5,37.85 31.62,37.85 31.62,41.02 31.75,41.15 v31.75,41.4
SCLK_3V  (via drill 0.5)
  Top 0.254: 29.46,23.88 30.23,23.88 30.48,24.13 30.48,25.53 30.23,25.78 20.57,25.78 18.16,28.19 18.16,32.13 16.88,33.41 6.54,33.41 X1.5 | U4.6 27.41,23.88 29.46,23.88 | v29.59,23.75 29.46,23.88 | EINK1.13 61.59,27.17 62.61,28.19 v63.63,28.19 | v31.24,34.16 31.24,34.39 31.49,34.65 U1.18 37.29,34.65 v38.71,36.07
  Bottom 0.254: v29.59,23.75 29.72,23.75 29.72,23.88 30.73,24.89 30.73,33.66 v31.24,34.16 | v63.63,28.19 63.63,28.96 57.4,35.18 39.6,35.18 v38.71,36.07
SDCS  (via drill 0.5)
  Top 0.254: R2.1 28.57,16.3 28.57,12.06 | 28.57,12.06 JP2.10 | v28.19,12.06 28.57,12.06 | v33.78,45.59 36.2,45.59 36.45,45.34 X2.10 | v25.15,41.53 23.62,41.53 20.83,38.73 20.83,31.75 v21.72,30.86 23.37,30.86 24.55,32.05 U1.7
  Bottom 0.254: v21.72,30.86 17.27,30.86 15.24,28.83 15.24,13.34 16.51,12.06 v28.19,12.06 | v33.78,45.59 29.72,45.59 25.65,41.53 v25.15,41.53
SDCS_3V  (via drill 0.5)
  Top 0.254: U1.13 29.57,31.39 28.7,32.26 v28.7,32.51 | X1.2 13.18,30.07 v15.24,32.13
  Bottom 0.254: v28.7,32.51 23.62,37.59 20.7,37.59 v15.24,32.13
SRAMCS  (via drill 0.5)
  Top 0.254: R3.1 30.48,15.66 v30.48,13.97 30.48,8.89 31.11,8.26 JP2.9 | v23.88,40.39 23.88,39.62 21.34,37.08 21.34,33.15 22.48,32 v22.86,32 23.55,32.7 U1.6 | v35.43,46.61 35.94,46.61 36.96,45.59 36.95,45.58 X2.11
  Bottom 0.254: v22.86,32 22.86,22.23 30.48,14.61 v30.48,13.97 | v35.43,46.61 28.57,46.61 23.88,41.91 v23.88,40.39
SRAMCS_3V  (via drill 0.5)
  Top 0.254: U4.1 32.61,21.34 v34.42,21.34 | U1.14 31.71,32.05 31.62,32.13 v31.62,32.26
  Bottom 0.254: v31.62,32.26 31.5,32.38 31.37,32.38 31.37,24.26 34.29,21.34 v34.42,21.34
VGH  (via drill 0.5)
  Top 0.254: D3.C 49.25,32.31 49.97,31.59 C3.1 50.35,30.73 v51.56,30.73 | EINK1.21 57.43,23.17 56.78,22.52 v56.78,22.27
  Bottom 0.254: v56.78,22.27 53.09,25.96 53.09,29.21 v51.56,30.73
VGL  (via drill 0.5)
  Top 0.254: 40.05,37.44 40.05,38.09 D1.A | v40.36,33.66 40.36,35.31 C4.1 | EINK1.23 61.67,22.17 v63.12,23.62
  Top 0.406: C4.1 40.65,36.83 40.05,37.44
  Bottom 0.254: v63.12,23.62 63.12,26.32 61.77,27.67 61.77,28.88 56.49,34.16 40.87,34.16 v40.36,33.66
VIN  (via drill 0.5)
  Top 0.254: R1.2 R6.2 R2.2 R3.2 R5.2 40.16,18.63 v40.89,19.36 48.19,19.36 48.38,19.18 | U2.1 48.76,23.99 C20.1 48.76,18.8 48.38,19.18 | JP2.1 51.44,8.89 48.38,11.95 48.38,19.18 | X2.1 31.95,43.12 v30.35,41.53
  Bottom 0.254: v40.89,19.36 40.89,26.29 35.43,31.75 35.43,42.29 31.11,42.29 v30.35,41.53

### Text on the board
Pinguin_tBackup: 2.7" Diagonal E-Ink Display | with SRAM buffer & MicroSD card | ENA | RST | SRCS | ECS | MISO | GND | VIN | BUSY | SDCS | D/C | MOSI | SCK | 3V3
Pinguin_bBackup: 2.7" Diagonal E-Ink Display / Adafruit Industries | ENA | RST | SRCS | ECS | MISO | GND | VIN | BUSY | SDCS | D/C | MOSI | SCK | 3V3